# EAGLE design ledboard_noISP (EAGLE 6.6.0)
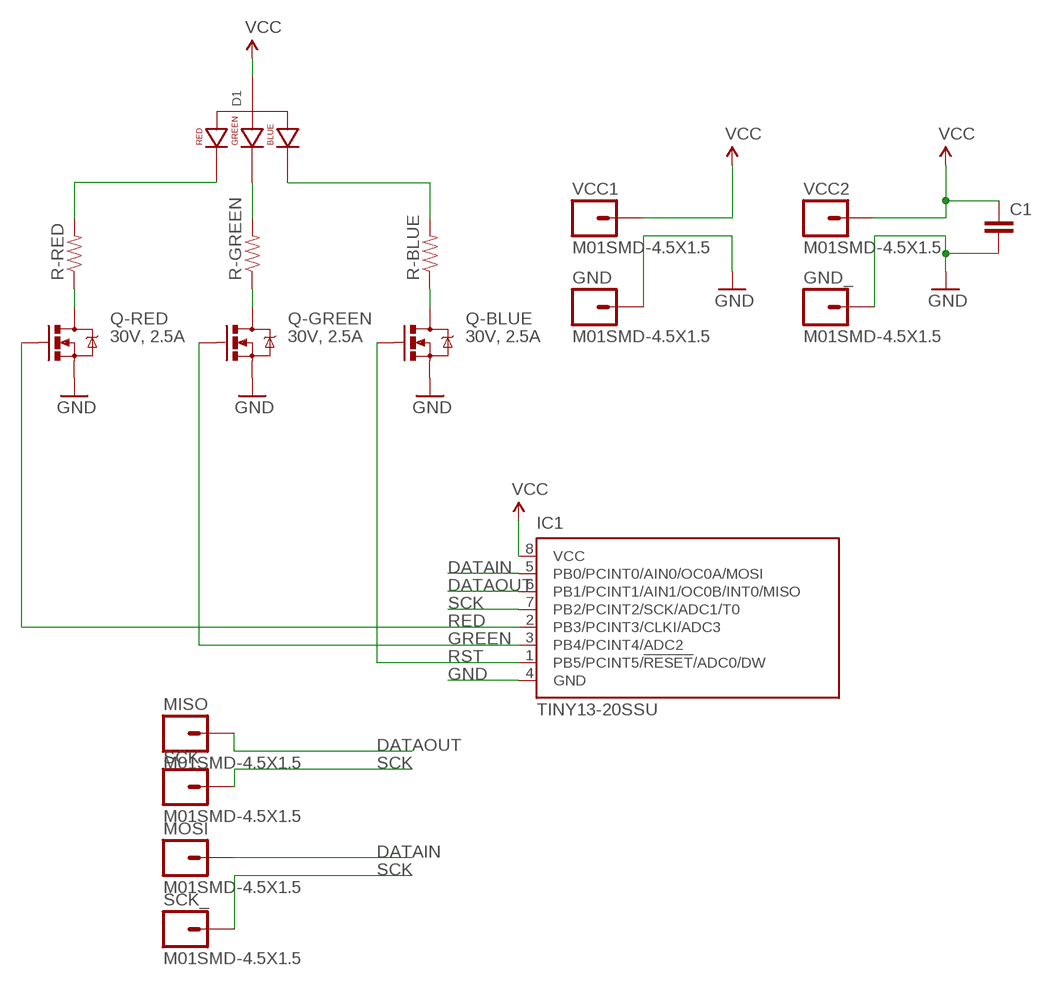
[diagram p0: schematic, sheet 1]

## Parts
C1  CAP0805  [0805]
D1  LED-RGB-CA-THRUCLEAR  [LED-RGB-THRU]
GND  M01SMD-4.5X1.5  [PAD-1.5X4.5]
GND_  M01SMD-4.5X1.5  [PAD-1.5X4.5]
IC1  TINY13-20SSU  [8S1]
MISO  M01SMD-4.5X1.5  [PAD-1.5X4.5]
MOSI  M01SMD-4.5X1.5  [PAD-1.5X4.5]
Q-BLUE  30V, 2.5A  MOSFET-NCHANNELBSS123LT1G  [SOT23]
Q-GREEN  30V, 2.5A  MOSFET-NCHANNELBSS123LT1G  [SOT23]
Q-RED  30V, 2.5A  MOSFET-NCHANNELBSS123LT1G  [SOT23]
R-BLUE  RESISTOR0603  [0603-RES]
R-GREEN  RESISTOR0603  [0603-RES]
R-RED  RESISTOR0603  [0603-RES]
SCK  M01SMD-4.5X1.5  [PAD-1.5X4.5]
SCK_  M01SMD-4.5X1.5  [PAD-1.5X4.5]
VCC1  M01SMD-4.5X1.5  [PAD-1.5X4.5]
VCC2  M01SMD-4.5X1.5  [PAD-1.5X4.5]

## Nets
DATAIN: IC1.5(PB0/PCINT0/AIN0/OC0A/MOSI) MOSI.P$1
DATAOUT: IC1.6(PB1/PCINT1/AIN1/OC0B/INT0/MISO) MISO.P$1
GND: C1.2 GND.P$1 GND_.P$1 IC1.4(GND) Q-BLUE.2(S) Q-GREEN.2(S) Q-RED.2(S)
GREEN: IC1.3(PB4/PCINT4/ADC2) Q-GREEN.1(G)
N$1: D1.1(RED_CATHODE) R-RED.2
N$2: Q-RED.3(D) R-RED.1
N$3: D1.4(BLUE_CATHODE) R-BLUE.2
N$4: D1.3(GREEN_CATHODE) R-GREEN.2
N$5: Q-GREEN.3(D) R-GREEN.1
N$6: Q-BLUE.3(D) R-BLUE.1
RED: IC1.2(PB3/PCINT3/CLKI/ADC3) Q-RED.1(G)
RST: IC1.1(PB5/PCINT5/!RESET!/ADC0/DW) Q-BLUE.1(G)
SCK: IC1.7(PB2/PCINT2/SCK/ADC1/T0) SCK.P$1 SCK_.P$1
VCC: C1.1 D1.2(ANODE) IC1.8(VCC) VCC1.P$1 VCC2.P$1

## Library data of the parts
C1 = SparkFun-Passives:CAP: Capacitor Standard 0603 ceramic capacitor, and 0.1" leaded capacitor.
D1 = SparkFun-LED:LED-RGB-CA-THRU: RGB Through-hole common anode SparkFun store front COM-10821 (diffuse) COM-10820 (clear); PROD_ID: DIO-10631
GND GND_ MISO MOSI SCK SCK_ VCC1 VCC2 = SparkFun-Connectors:M01: Header 1 Standard 1-pin 0.1" header. Use with straight break away headers (SKU : PRT-00116), right angle break away headers (PRT-00553), swiss pins (PRT-00743), machine pins (PRT-00117), and female headers (PRT-00115).
IC1 = atmel:TINY13: 8-bit AVR Microcontroller with 1K Bytes In-System Programmable Flash Source: http://www.atmel.com/dyn/resources/prod_documents/2535S.pdf; MPN: ATTINY13-20SSU; OC_FARNELL: 1455133; OC_NEWARK: 58M3771
Q-BLUE Q-GREEN Q-RED = SparkFun-DiscreteSemi:MOSFET-NCHANNEL: Common NMOSFET Parts MFG P/N Store ID Prod ID FDD8780 TRANS-09984 SI7820DN TRANS-11055 FDS6630A IC-08089 2N7002PW TRANS-11151 FQP30N06L COM-10213 TRANS-10060 BSS123LT1G TRANS-08345 BSS138 TRANS-00830 BS170 2N7000; PROD_ID: TRANS-08345
R-BLUE R-GREEN R-RED = SparkFun-Resistors:RESISTOR: Resistor Basic schematic elements and footprints for 0603, 1206, and PTH resistors.

## Board
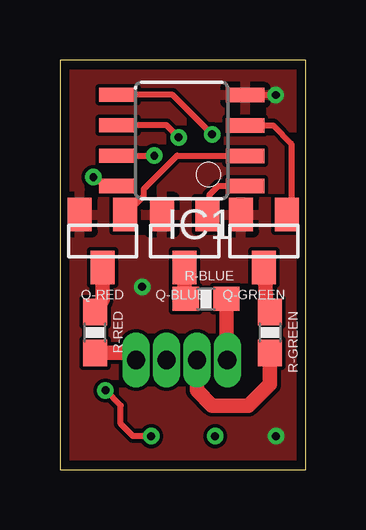
[diagram p1: board, top side]
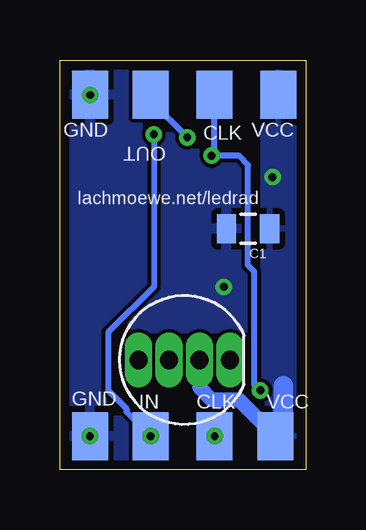
[diagram p2: board, bottom side, seen from below]

Size 10.27 x 17.07 mm. Coordinates in mm from the lower left corner, seen from the top.
Outline: 0,0 10.27,0 10.27,17.07 0,17.07 0,0
Copper layers (1*16): Top 0.0356mm / dielectric 1.5011mm / Bottom 0.0356mm
Design rules "OSHpark": minimum track width 6mil, minimum drill 13mil, track to track 6mil, track to pad 6mil, pad to pad 6mil, via to via 6mil, smd to smd 6mil, copper to edge 15mil, drill to drill 6mil, minimum pad ring 7mil, minimum via ring 7mil, stop-mask expansion 3mil, vias tented up to drill 0mil, thermal gap 10mil

### Footprints (pad centres in the part's own frame; a part is rotated, then mirrored left to right if it is on the bottom)
0805 = smd 0.8 x 1.2: 1 -0.9,0; 2 0.9,0
LED-RGB-THRU = drill 0.762 pad 0.889 long: 1 1.905,0; 2 0.635,0; 3 -0.635,0; 4 -1.905,0
PAD-1.5X4.5 = smd 1.5 x 2: P$1 0,0
8S1 = smd 0.6 x 1.6: 1 -1.905,-2.654; 2 -0.645,-2.654; 3 0.625,-2.654; 4 1.895,-2.654; 5 1.905,2.654; 6 0.635,2.654; 7 -0.635,2.654; 8 -1.905,2.654
SOT23 = smd 1 x 1.4: 1 -0.95,-1.1; 2 0.95,-1.1; 3 0,1.1
0603-RES = smd 1.1 x 1: 1 -0.85,0; 2 0.85,0

### Placement (x,y rotation side)
C1  2.41,10.03 180 bottom
D1  5.08,4.57 0 bottom
GND  9.02,15.62 0 bottom
GND_  9.02,1.4 0 bottom
IC1  5.08,13.72 90 top
MISO  6.48,15.62 0 bottom
MOSI  6.48,1.4 0 bottom
Q-BLUE  5.21,9.53 180 top
Q-GREEN  8.51,9.53 180 top
Q-RED  1.78,9.53 180 top
R-BLUE  6.1,7.11 0 top
R-GREEN  8.76,5.71 270 top
R-RED  1.46,5.71 270 top
SCK  3.81,15.62 0 bottom
SCK_  3.81,1.4 0 bottom
VCC1  1.14,15.62 0 bottom
VCC2  1.27,1.4 0 bottom

### Tracks (layer width: path | path; a pad name or v marks a point on that pad's centre or on a via)
DATAIN  (via drill 0.33 pad 0.25)
  Top 0.254: v6.35,13.97 4.7,15.62 IC1.5
  Bottom 0.254: v6.35,13.97 6.35,7.62 8.26,5.71 8.26,3.3 7.49,2.54 7.49,2.41 MOSI.P$1
  other vias: 6.48,1.4
DATAOUT  (via drill 0.33 pad 0.25)
  Top 0.254: v4.95,13.84 4.45,14.35 IC1.6
  Bottom 0.254: MISO.P$1 6.48,15.37 v4.95,13.84
GND  (via drill 0.33 pad 0.25)
  Top 0.254: IC1.4 v9.01,15.61 9.14,15.62
  Bottom 0.254: v9.01,15.61 GND.P$1
  other vias: 3.43,7.62 9.02,1.4
  pour Top: -1.65,23.88 12.45,23.88 12.45,-1.9 -1.65,-1.9
  pour Bottom: 2.29,17.91 10.79,17.91 10.79,-0.64 2.29,-0.64
GREEN
  Top 0.254: IC1.3 8.9,14.34 9.65,13.59 9.65,10.71 Q-GREEN.1
N$1
  Top 0.61: R-RED.2 2.88,4.87 D1.1
N$2
  Top 0.61: Q-RED.3 1.78,7.07 R-RED.1
N$3
  Top 0.61: R-BLUE.2 6.95,4.48 D1.4
N$4
  Top 0.61: R-GREEN.2 8.76,3.56 7.87,2.67 6.35,2.67 5.71,3.3 D1.3
N$5
  Top 0.61: Q-GREEN.3 8.64,6.69 R-GREEN.1
N$6
  Top 0.61: Q-BLUE.3 5.21,7.15 R-BLUE.1
RED
  Top 0.254: Q-RED.1 3.49,11.39 3.49,11.68 4.89,13.08 IC1.2
RST
  Top 0.254: IC1.1 7.44,11.81 6.6,11.81 6.22,11.43 6.22,10.67 Q-BLUE.1
SCK  (via drill 0.33 pad 0.25)
  Top 0.254: SCK_.P$1 3.05,1.4 2.54,1.91 2.54,2.67 v1.91,3.3 | IC1.7 v3.94,13.08
  Bottom 0.254: v1.91,3.3 2.16,3.56 2.16,8.25 2.41,8.51 2.41,12.69 2.81,13.08 3.81,13.08 | 3.81,13.08 SCK.P$1 | v3.94,13.08 3.81,13.08
  other vias: 3.81,1.4
VCC  (via drill 0.33 pad 0.25)
  Top 0.254: IC1.8 1.91,11.81 v1.4,12.19
  Bottom 0.61: VCC2.P$1 2.79,2.92 3.94,2.92 4.45,3.43 D1.2
  Bottom 0.813: 1.08,1.27 0.95,1.4 0.95,3.49
  pour Bottom: 1.78,17.91 -0.25,17.91 -0.25,-0.25 1.78,-0.25

### Text on the board
bNames: VCC | CLK | GND | OUT | lachmoewe.net/ledrad | VCC | CLK | IN | GND